# Altium project bdk_pl_power_connector.PrjPcb
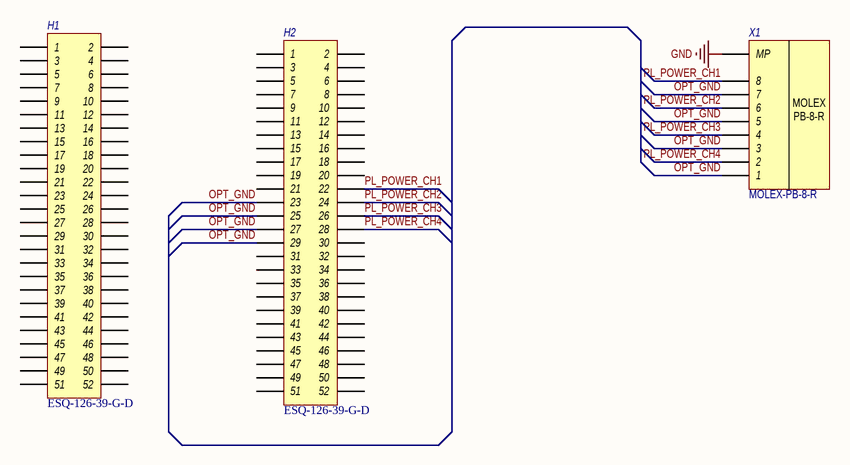
[diagram p0: bdk_pl_power_connector.SchDoc]
1 sheet, 3 parts. Net scope: global (net labels, ports and power ports of the same name join across sheets).
Board file: bdk_pl_power_connector.PcbDoc

## Sheet bdk_pl_power_connector.SchDoc: =GlobalProjectName
size 209 x 297 mm; SheetNumber: 1; SheetTotal: 1; PageSetup: Record=PageOptions|CenterHorizontal=True|CenterVertical=True|PrintScale=1.00|XCorrection=1.00|YCorrection=1.00|PrintKind=1|BorderSize=5000000|LeftOffset=0|BottomOffset=0|Orientation=2|PaperLength=1000|PaperWidth=1000|Scale=100|PaperSource=15|PrintQuality=1200|MediaType=1|DitherType=10|PaperKind=A3|PrintScaleMode=1; Weight: -; ScaleFactor: -

### Parts
H1  ESQ-126-39-G-D  [ESQ-126-39-G-D]
H2  ESQ-126-39-G-D  [ESQ-126-39-G-D]
X1  MOLEX-PB-8  [MOLEX-PB-8-R]  (value not drawn)

### Nets
GND: X1.MP
OPT_GND: H2.23 H2.25 H2.27 H2.29 X1.1 X1.3 X1.5 X1.7
PL_POWER_CH1: H2.22 X1.8
PL_POWER_CH2: H2.24 X1.6
PL_POWER_CH3: H2.26 X1.4
PL_POWER_CH4: H2.28 X1.2

Not connected (* = marked no-connect by the designer): H1 1 2 3 4 5 6 7 8 9 10 11 12 13 14 15 16 17 18 19 20 21 22 23 24 25 26 27 28 29 30 31 32 33 34 35 36 37 38 39 40 41 42 43 44 45 46 47 48 49 50 51 52; H2 1 2 3 4 5 6 7 8 9 10 11 12 13 14 15 16 17 18 19 20 21 30 31 32 33 34 35 36 37 38 39 40 41 42 43 44 45 46 47 48 49 50 51 52

### Notes on the sheet
- Перв. примен.
- Справ. №
- Подп. и дата
- Инв. № дубл.
- Взам. инв. №
- Разраб.
- Изм.
- Лист
- № докум.
- Подп.
- Дата
- Литера
- Масса
- Масштаб
- Пров.
- Т.контр.
- Листов
- Инв. № подл.
- Н.контр.
- Утв.
- Форма 1 ГОСТ 2.104-2006
- Копировал
- Формат А4
- (in symbol MOLEX-PB-8) MOLEX / PB-8-R

### Library data of the parts
H1 H2 = ESQ-126-39-G-D: Elevated socket, dual-row, 26-pin per row; Назначение: Сквозной разъем, двойно, 52 контакта, шаг 2,54 мм; Потребление, Вт: 0,00; Наименование: ESQ-126-39-G-D; ComponentLink1Description: DataSheet; ComponentLink1URL: https://static.chipdip.ru/lib/071/DOC025071643.pdf
X1 = MOLEX-PB-8: MOLEX PicoBlade 8-pin; Назначение: MOLEX PicoBlade 8-pin to board; Потребление, Вт: 0,001; Наименование: MOLEX-PB-8-R